# Altium schematic sheet Power.SchDoc
size A4
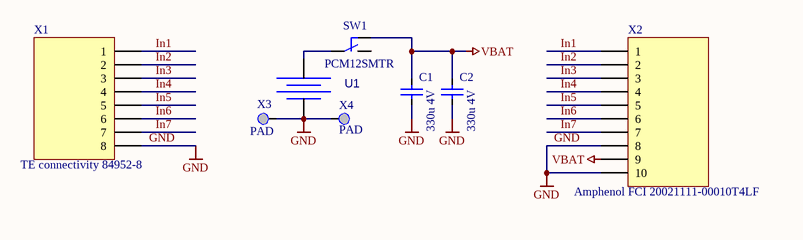
[diagram p0: Power.SchDoc]

## Parts
C1  330u 4V  [CAPC3225L]
C2  330u 4V  [CAPC3225L]
SW1  PCM12SMTR  [PCM12SMTR]
U1  Keystone 3000  [BK-3000]  (value not drawn)
X1  TE connectivity 84952-8  [ZIF connector 84952-8]
X2  Amphenol FCI 20021111-00010T4LF  [HDR-1.27mm-2X5]
X3  PAD  [PAD3mm]
X4  PAD  [PAD3mm]

## Nets
GND: C1.2 C2.2 U1.2(-) X1.8 X2.8 X2.10 X3.1 X4.1
VBAT: C1.1 C2.1 SW1.3 X2.9
In1: X1.1 X2.1
In2: X1.2 X2.2
In3: X1.3 X2.3
In4: X1.4 X2.4
In5: X1.5 X2.5
In6: X1.6 X2.6
In7: X1.7 X2.7
NetSW1_2: SW1.2 U1.1(+)

Not connected (* = marked no-connect by the designer): SW1 1

## Library data of the parts
C1 C2 = Capacitor: PartNumber: 490-13976-1-ND #Digikey; Value: 330u 4V; Package: 1210
SW1 = SPDT: Miniature Surface Mount Switches; PartNumber: 401-2016-1-ND #Digikey; Value: PCM12SMTR
U1 = Battery: PartNumber: 36-3000CT-ND #Digikey; Value: Keystone 3000; Package: CR1220 battery
X1 = DB-8F: Header; PartNumber: A100249CT-ND #Digikey; Value: TE connectivity 84952-8; Package: ZIF-8
X2 = DB-10F: Header; PartNumber: 609-3712-ND #Digikey; Value: Amphenol FCI 20021111-00010T4LF
X3 X4 = PAD: PartNumber: -; Value: -